# Altium project OmnicronAltium.PrjPcb
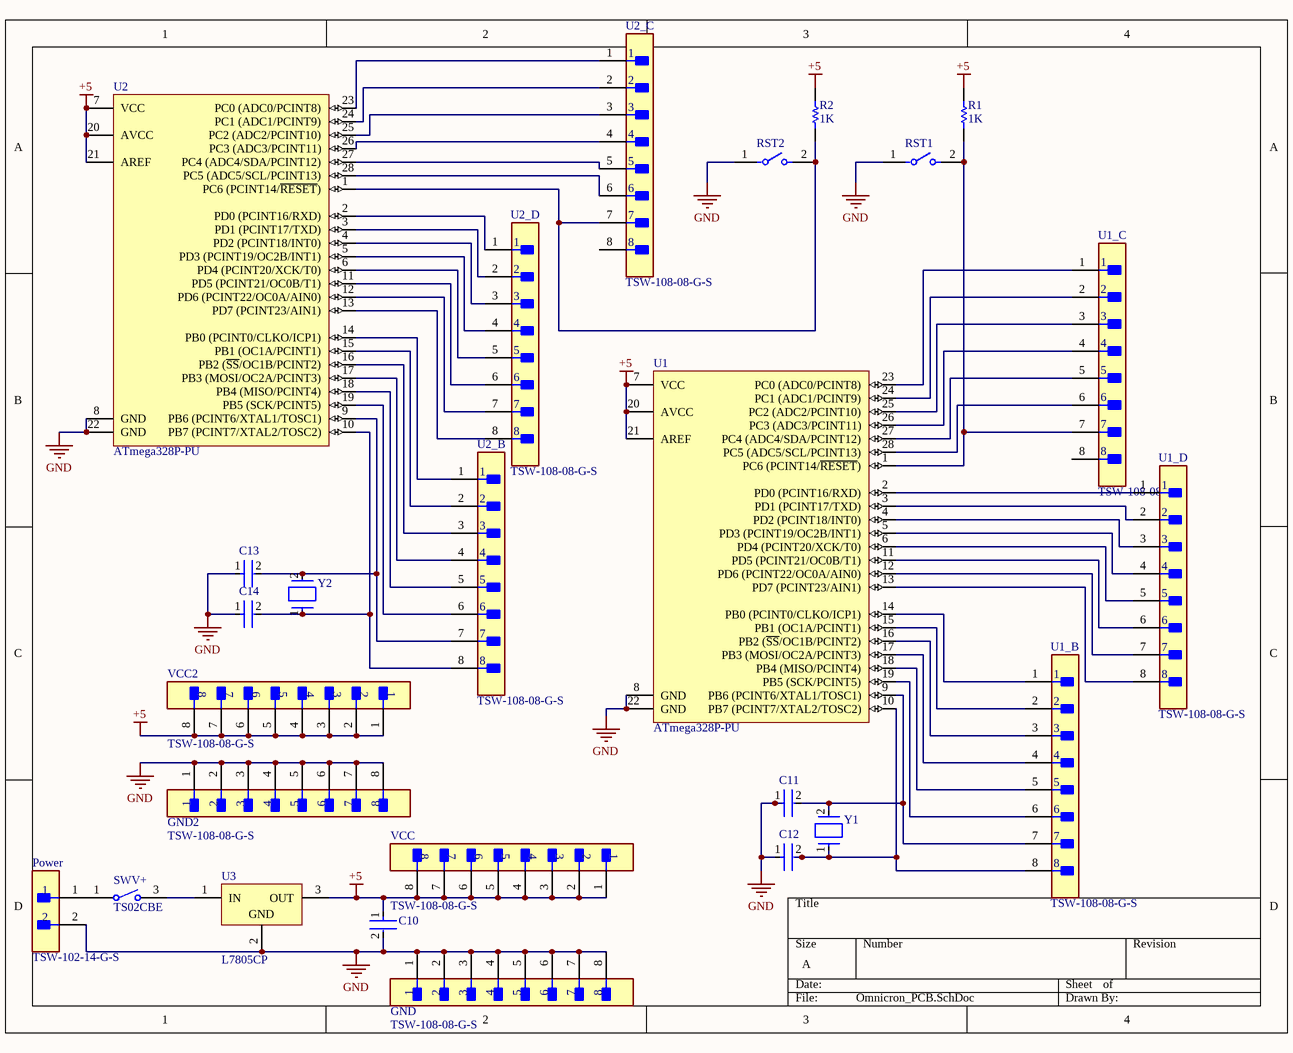
[diagram p0: Omnicron_PCB.SchDoc]
1 sheet, 26 parts. Net scope: global (net labels, ports and power ports of the same name join across sheets).
Board file: Omnicrom_PCB.PcbDoc

## Sheet Omnicron_PCB.SchDoc
size A; SheetNumber: 1; SheetTotal: 1

### Parts
C10  (no value)  [FP-561R10TSQ30-MFG]
C11  (no value)  [FP-561R10TSQ30-MFG]
C12  (no value)  [FP-561R10TSQ30-MFG]
C13  (no value)  [FP-561R10TSQ30-MFG]
C14  (no value)  [FP-561R10TSQ30-MFG]
GND  TSW-108-08-G-S  [FP-TSW-108-08-G-S-MFG]
GND2  TSW-108-08-G-S  [FP-TSW-108-08-G-S-MFG]
Power  TSW-102-14-G-S  [FP-TSW-102-14-G-S-MFG]
R1  1K  [RESA60-630X240]
R2  1K  [RESA60-630X240]
RST1  (no value)  [FP-FSM2JART-MFG]
RST2  (no value)  [FP-FSM2JART-MFG]
SWV+  TS02CBE  [CKCP-TS02CBE_V]
U1  ATmega328P-PU  [28P3]
U1_B  TSW-108-08-G-S  [FP-TSW-108-08-G-S-MFG]
U1_C  TSW-108-08-G-S  [FP-TSW-108-08-G-S-MFG]
U1_D  TSW-108-08-G-S  [FP-TSW-108-08-G-S-MFG]
U2  ATmega328P-PU  [28P3]
U2_B  TSW-108-08-G-S  [FP-TSW-108-08-G-S-MFG]
U2_C  TSW-108-08-G-S  [FP-TSW-108-08-G-S-MFG]
U2_D  TSW-108-08-G-S  [FP-TSW-108-08-G-S-MFG]
U3  L7805CP  [TO220FP]
VCC  TSW-108-08-G-S  [FP-TSW-108-08-G-S-MFG]
VCC2  TSW-108-08-G-S  [FP-TSW-108-08-G-S-MFG]
Y1  (no value)  [FP-ECS-80-20-4X-MFG]
Y2  (no value)  [FP-ECS-80-20-4X-MFG]

### Nets
+5: C10.1 R1.1 R2.1 U1.7(VCC) U1.20(AVCC) U1.21(AREF) U2.7(VCC) U2.20(AVCC) U2.21(AREF) U3.3(OUT) VCC.1 VCC.2 VCC.3 VCC.4 VCC.5 VCC.6 VCC.7 VCC.8 VCC2.1 VCC2.2 VCC2.3 VCC2.4 VCC2.5 VCC2.6 VCC2.7 VCC2.8
GND: C10.2 C11.1 C12.1 C13.1 C14.1 GND.1 GND.2 GND.3 GND.4 GND.5 GND.6 GND.7 GND.8 GND2.1 GND2.2 GND2.3 GND2.4 GND2.5 GND2.6 GND2.7 GND2.8 Power.2 RST1.1 RST2.1 U1.8(GND) U1.22(GND) U2.8(GND) U2.22(GND) U3.2(GND)
NetC11_2: C11.2 U1.9(PB6_(PCINT6/XTAL1/TOSC1)) U1_B.7 Y1.2
NetC12_2: C12.2 U1.10(PB7_(PCINT7/XTAL2/TOSC2)) U1_B.8 Y1.1
NetC13_2: C13.2 U2.9(PB6_(PCINT6/XTAL1/TOSC1)) U2_B.7 Y2.2
NetC14_2: C14.2 U2.10(PB7_(PCINT7/XTAL2/TOSC2)) U2_B.8 Y2.1
NetPower_1: Power.1 SWV+.1
NetR1_2: R1.2 RST1.2 U1.1(PC6_(PCINT14/~{RESET})) U1_C.7
NetR2_2: R2.2 RST2.2 U2.1(PC6_(PCINT14/~{RESET})) U2_C.7
NetSWV+_3: SWV+.3 U3.1(IN)
NetU1_2: U1.2(PD0_(PCINT16/RXD)) U1_D.1
NetU1_3: U1.3(PD1_(PCINT17/TXD)) U1_D.2
NetU1_4: U1.4(PD2_(PCINT18/INT0)) U1_D.3
NetU1_5: U1.5(PD3_(PCINT19/OC2B/INT1)) U1_D.4
NetU1_6: U1.6(PD4_(PCINT20/XCK/T0)) U1_D.5
NetU1_11: U1.11(PD5_(PCINT21/OC0B/T1)) U1_D.6
NetU1_12: U1.12(PD6_(PCINT22/OC0A/AIN0)) U1_D.7
NetU1_13: U1.13(PD7_(PCINT23/AIN1)) U1_D.8
NetU1_14: U1.14(PB0_(PCINT0/CLKO/ICP1)) U1_B.1
NetU1_15: U1.15(PB1_(OC1A/PCINT1)) U1_B.2
NetU1_16: U1.16(PB2_(~{SS}/OC1B/PCINT2)) U1_B.3
NetU1_17: U1.17(PB3_(MOSI/OC2A/PCINT3)) U1_B.4
NetU1_18: U1.18(PB4_(MISO/PCINT4)) U1_B.5
NetU1_19: U1.19(PB5_(SCK/PCINT5)) U1_B.6
NetU1_23: U1.23(PC0_(ADC0/PCINT8)) U1_C.1
NetU1_24: U1.24(PC1_(ADC1/PCINT9)) U1_C.2
NetU1_25: U1.25(PC2_(ADC2/PCINT10)) U1_C.3
NetU1_26: U1.26(PC3_(ADC3/PCINT11)) U1_C.4
NetU1_27: U1.27(PC4_(ADC4/SDA/PCINT12)) U1_C.5
NetU1_28: U1.28(PC5_(ADC5/SCL/PCINT13)) U1_C.6
NetU2_2: U2.2(PD0_(PCINT16/RXD)) U2_D.1
NetU2_3: U2.3(PD1_(PCINT17/TXD)) U2_D.2
NetU2_4: U2.4(PD2_(PCINT18/INT0)) U2_D.3
NetU2_5: U2.5(PD3_(PCINT19/OC2B/INT1)) U2_D.4
NetU2_6: U2.6(PD4_(PCINT20/XCK/T0)) U2_D.5
NetU2_11: U2.11(PD5_(PCINT21/OC0B/T1)) U2_D.6
NetU2_12: U2.12(PD6_(PCINT22/OC0A/AIN0)) U2_D.7
NetU2_13: U2.13(PD7_(PCINT23/AIN1)) U2_D.8
NetU2_14: U2.14(PB0_(PCINT0/CLKO/ICP1)) U2_B.1
NetU2_15: U2.15(PB1_(OC1A/PCINT1)) U2_B.2
NetU2_16: U2.16(PB2_(~{SS}/OC1B/PCINT2)) U2_B.3
NetU2_17: U2.17(PB3_(MOSI/OC2A/PCINT3)) U2_B.4
NetU2_18: U2.18(PB4_(MISO/PCINT4)) U2_B.5
NetU2_19: U2.19(PB5_(SCK/PCINT5)) U2_B.6
NetU2_23: U2.23(PC0_(ADC0/PCINT8)) U2_C.1
NetU2_24: U2.24(PC1_(ADC1/PCINT9)) U2_C.2
NetU2_25: U2.25(PC2_(ADC2/PCINT10)) U2_C.3
NetU2_26: U2.26(PC3_(ADC3/PCINT11)) U2_C.4
NetU2_27: U2.27(PC4_(ADC4/SDA/PCINT12)) U2_C.5
NetU2_28: U2.28(PC5_(ADC5/SCL/PCINT13)) U2_C.6

Not connected (* = marked no-connect by the designer): U1_C 8; U2_C 8

### Library data of the parts
C10-C14 = CMP-02417-000081-1: CAP CER 30PF 1KV U2J RADIAL; Tolerance: 10%; Application(s): GENERAL PURPOSE; Temperature Coefficient: 120ppm/°C; Lead Diameter: 0.51mm; Dissipation Factor: 2%; Lead/Base Style: Straight; Contact Plating: Tin; Dielectric: U2J; Width: 0.25inch; Voltage: 1kV; Lead Pitch: 6.4mm; Voltage Rating: 1kV; Construction: RADIAL; Series: Cera-Mite 561R; Capacitance: 30pF; Mount: Through Hole; RoHS Compliant: Yes; Number of Pins: 2; Radiation Hardening: No; Packaging: Bulk; Min Operating Temperature: -55°C; Height: 0.25inch; Height - Seated (Max): 0.429inch; Depth: 4mm; Max Operating Temperature: 105°C; Termination: Radial; Case/Package: Radial; Weight: 0.01lb; Lead Free: Lead Free; Voltage Rating (DC): 1kV; Diameter: 7.4mm; Package Quantity: 500; Resistor Type: Ceramic; Length: 2inch
GND GND2 U1_B U1_C U1_D U2_B U2_C U2_D VCC VCC2 = CMP-02766-000001-1: CONN HEADER VERT 8POS 2.54MM; Manufacturer: Samtec; Number Of Contacts: 8; Conn Orientation: Straight; Conn Gender: Male; Device Class L1: Connectors; ComponentLink2Description: Datasheet; Digikey Description: CONN HEADER VERT 8POS 2.54MM; ComponentLink2URL: http://suddendocs.samtec.com/catalog_english/tsw_th.pdf; Temperature: -55°C to +125°C; RoHS: TRUE; Mouser Description: TSW - Samtec 2.54mm Pin Header 13.46mm Overall Pin Length 5.08mm Tail; Automotive: No; Temperature Range High: +125°C; Package: TSW-108-08-G-S; Device Class L3: unset; Manufacturer Part Number: TSW-108-08-G-S; Pitch: 2.54mm; Number Of Rows: 1; Lead Free: Yes; Height: 8.71mm; Contact Material: Gold,Nickel; Footprint Url: http://suddendocs.samtec.com/prints/tsw-xxx-xx-x-x-xx-xxx-footprint.pdf; Temperature Range Low: -55°C; Octopart: https://octopart.com/tsw-108-08-g-s-samtec-272653; Category: Conn; Device Class L2: Headers and Wire Housings
Power = CMP-02766-001740-1: CONN HEADER VERT 2POS 2.54MM; Number of Positions: 2; Max Current Rating: 7.6A; Gender: Male; Max Voltage Rating (AC): 550V; Contact Mating Length: 0.32inch; REACH SVHC: No SVHC; Width: 2.54mm; Insulation Material: PBT; Contact Shape: Square; Contact Plating: Gold; Min Operating Temperature: -55°C; Contact Material: Bronze; Color: Black; Number of Contacts: 2; Housing Material: Polyester; Orientation: Straight; Flammability Rating: UL94 V-0; Max Operating Temperature: 125°C; Contact Type: Male Pin; Radiation Hardening: No; Termination: Solder; RoHS Compliant: Yes; Lead Free: Lead Free; Fastening Type: Pull; Pitch: 2.54mm; Number of Rows: 1; Series: TSW; Insulation Color: Black; Package Quantity: 1; Connector Type: Header; Length: 5.08mm; Contact Finish - Mating: GOLD; Mount: Through Hole; Housing Color: Black; Depth: 2.54mm; Packaging: Bulk
R1 R2 = CMP-1659-00075-1: Axial Resistor, 1 KOhm, +/- 1%, 250 mW, -55 to 155 degC, 2-Pin THD, RoHS, Bulk; Voltage Rating: 250 V; Resistance: 10 kohm; Power Rating: 250 mW; ComponentLink2Description: Datasheet; RoHSCompliant: true; PackageReference: MFR-25; Case\Package: Axial; Max Operating Temperature: 155 degC; DatasheetVersion: Apr-13; Tolerance: 1%; ComponentLink1URL: http://www.yageo.com/; Length: 0.248 inch; ComponentLink2URL: http://www.yageo.com/documents/recent/Yageo%20LR_MFR_2013.pdf; Packaging: Bulk; Package Quantity: 200; PackageDescription: 2-Pin Axial Lead, Dia 2.4 mm, Body Length 6.3 mm; Min Operating Temperature: -55 degC; ComponentLink1Description: Manufacturer URL
RST1 RST2 = CMP-03407-000009-1: SWITCH TACTILE SPST-NO 0.05A 12V; Actuator Length: 0.7mm; Switch Function: Off-Mom; Throw Configuration: SPST; Electrical Life: 100000Cycles; Illumination Type: Non-Illuminated; Contact Resistance: 100mR; Operating Force: 260gf; Actuator Type: Standard; Actuator Material: Resin; Contact Current Rating: 50mA; Type: Switch; Contact Plating: Silver; ELV: Compliant; Lead Free: Lead Free; Max Voltage Rating (DC): 12V; Min Operating Temperature: -35°C; Mount: Through Hole; Series: FSMJRT; Max Operating Temperature: 105°C; RoHS Compliant: Yes; Termination: Solder; REACH SVHC: No SVHC; Contact Material: Copper Alloy; Orientation: Straight; Current Rating: 50mA; Package Quantity: 1000; Voltage Rating (DC): 12V; Packaging: Tape and Reel
SWV+ = CMP-2000-07317-1: Tiny Slide Switch, SPST, 20 V, -30 to 85 degC, 2-Pin THD, RoHS, Bulk; Manufacturer: C&K Components; Product Height (mm): 12.91mm; Actuator Style: TopSlide; Product Length (mm): 10.16mm; Switch Configuration: OFFNoneON; AC Voltage Rating (Max): 20V; Product Depth (mm): 5.08mm; Actuator Material: Nylon; Mounting Technology: ThroughHole; Manufacturer URL: http://www.ckswitches.com/; Type: Tiny; Pole Throw Configuration: SPST; Terminal Type: PCPins; Package Reference: TS02CBE; Package Description: 2-Pin Through Hole Device, Body 10.16 x 5.08 mm; Datasheet Version: 02/2016; Datasheet URL: http://www.ck-components.com/media/1426/ts_12feb16.pdf; Contact Material: CopperAlloy; Housing Material: N/A/StainlessSteel; Operating Temp Range: -30Cto85C; Contact Plating: Gold/Nickel; DC Voltage Rating (Max): 20V; Mounting Style: ThroughHole
U1 U2 = CMP-0095-00013-2: 8-bit AVR Microcontroller, 32KB Flash, 1KB EEPROM, 2KB SRAM, 28-pin PDIP, Industrial Grade (-40°C to 85°C); RevisionNote: DatasheetVersion updated. URLs added.; PackageVersion: revB, Sep-2001; PackageDescription: 28-lead (0.300"/7.62mm Wide) Plastic Dual Inline Package (PDIP); DatasheetVersion: revD, May-2011; ComponentLink1Description: Manufacturer URL; ComponentLink1URL: http://www.atmel.com/; PackageReference: 28P3; ComponentLink2Description: ATmega48A/48PA/88A/88PA/168A/168PA/328/328P Datasheet; ComponentLink3URL: http://www.atmel.com/dyn/resources/prod_documents/8271S.pdf; ComponentLink2URL: http://www.atmel.com/dyn/resources/prod_documents/8271.pdf; ComponentLink3Description: ATmega48A/48PA/88A/88PA/168A/168PA/328/328P Summary
U3 = CMP-0244-00474-1: Positive Voltage Regulator, 5V, 3-Pin TO-220FP; ComponentLink1Description: Manufacturer URL; ComponentLink2Description: Datasheet; DatasheetVersion: 16/11/2011; PackageDescription: TO, Thru-Hole, Vertical, Heatsink Mounted; 3 In-Line Leads; Pitch 2.54 mm; ComponentLink2URL: http://www.st.com/internet/com/TECHNICAL_RESOURCES/TECHNICAL_LITERATURE/DATASHEET/CD00000444.pdf; ComponentLink1URL: http://www.st.com; PackageVersion: 2011; PackageReference: TO220FP
Y1 Y2 = CMP-1669-00002-3: NexarPartId: 316504; Frequency Stability: 50ppm; ESR (Equivalent Series Resistance): 80Ω; Frequency: 8MHz; Tolerance: 0.003%; Load Capacitance: 20pF; Schedule B: 8541600025, 8541600025; Number of Pins: 49; Max Operating Temperature: 70°C; Lead Free: Lead Free; Height: 3.5mm; Termination: Radial; RoHS: Compliant; Frequency Tolerance: 0.003%; Packaging: Bulk; Mount: Through Hole; Width: 4.65mm; Length: 11.3538mm; Min Operating Temperature: -10°C